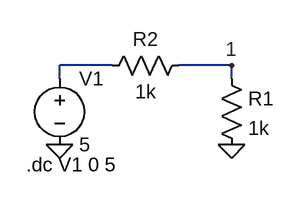
[diagram p0: schematic 1b.asc]
1b.asc, the LTspice schematic file:
Version 4
SHEET 1 880 680
WIRE 128 96 64 96
WIRE 272 96 208 96
WIRE 64 112 64 96
WIRE 272 112 272 96
FLAG 64 192 0
FLAG 272 192 0
FLAG 272 96 1
SYMBOL res 256 96 R0
SYMATTR InstName R1
SYMATTR Value 1k
SYMATTR SpiceLine tol=0
SYMBOL res 112 112 R270
WINDOW 0 32 56 VTop 2
WINDOW 3 0 56 VBottom 2
SYMATTR InstName R2
SYMATTR Value 1k
SYMATTR SpiceLine tol=0
SYMBOL voltage 64 96 R0
WINDOW 123 0 0 Left 0
WINDOW 39 0 0 Left 0
SYMATTR InstName V1
SYMATTR Value 5
TEXT 24 216 Left 2 !.dc V1 0 5

The netlist it stands for:
* 1b.asc
R1 1 0 1k tol=0
R2 N001 1 1k tol=0
V1 N001 0 5
.dc V1 0 5
.backanno
.end